# Altium schematic sheet 智能笔.SchDoc
size A1
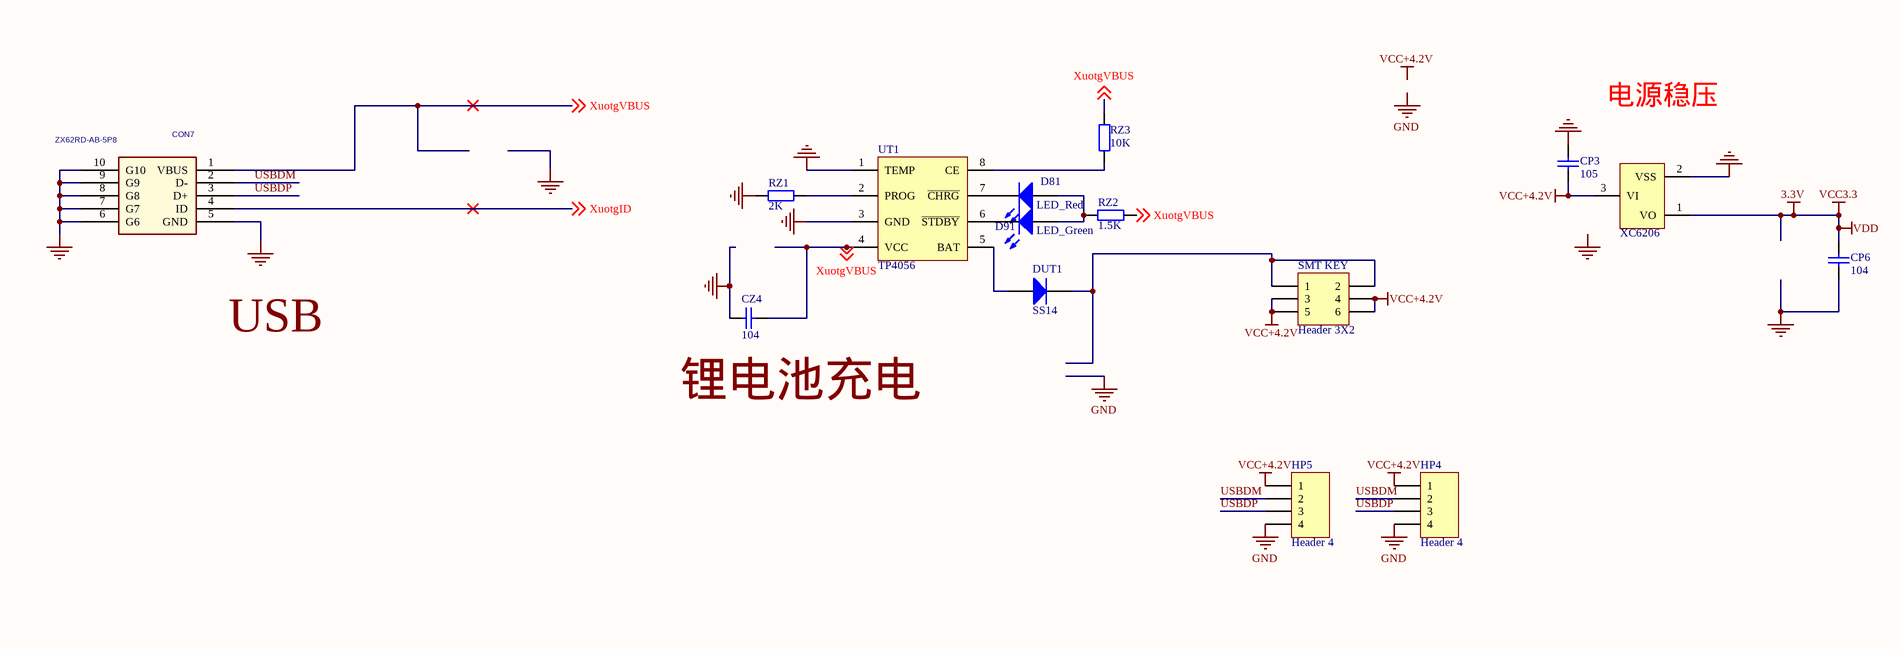
[diagram p0: 智能笔.SchDoc, top left]
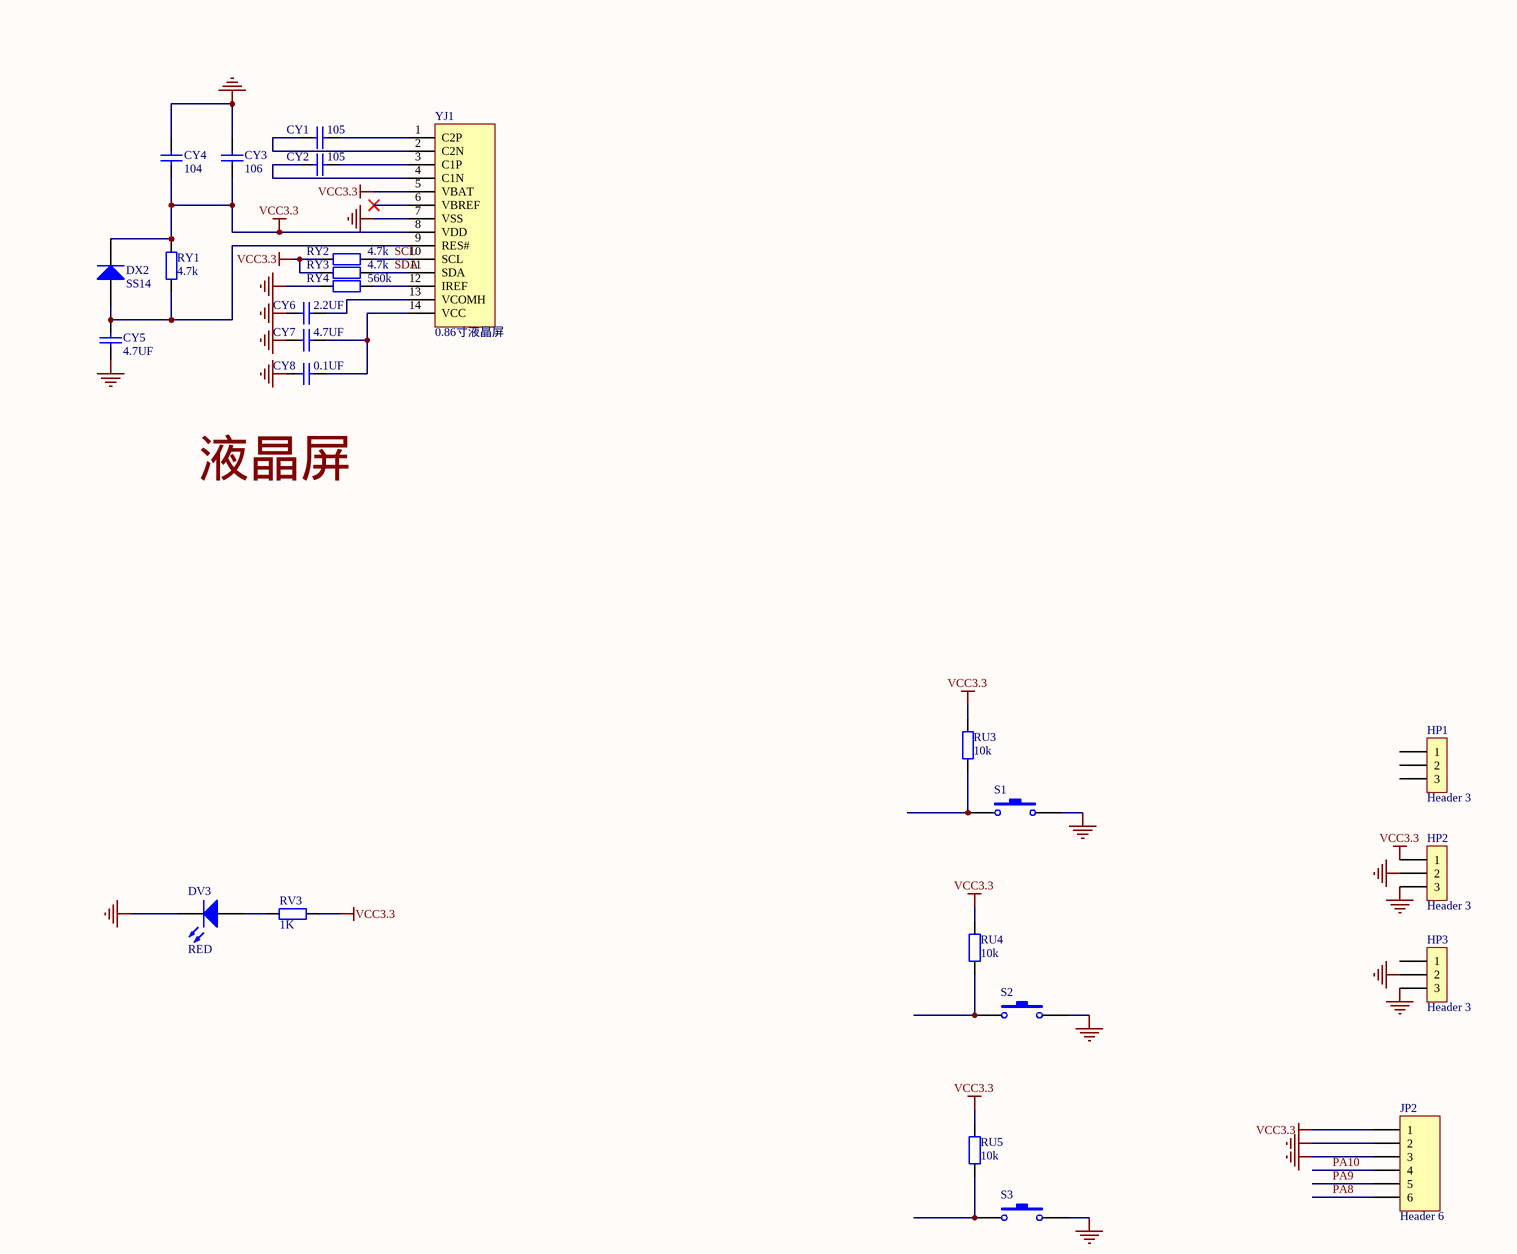
[diagram p1: 智能笔.SchDoc, top right]
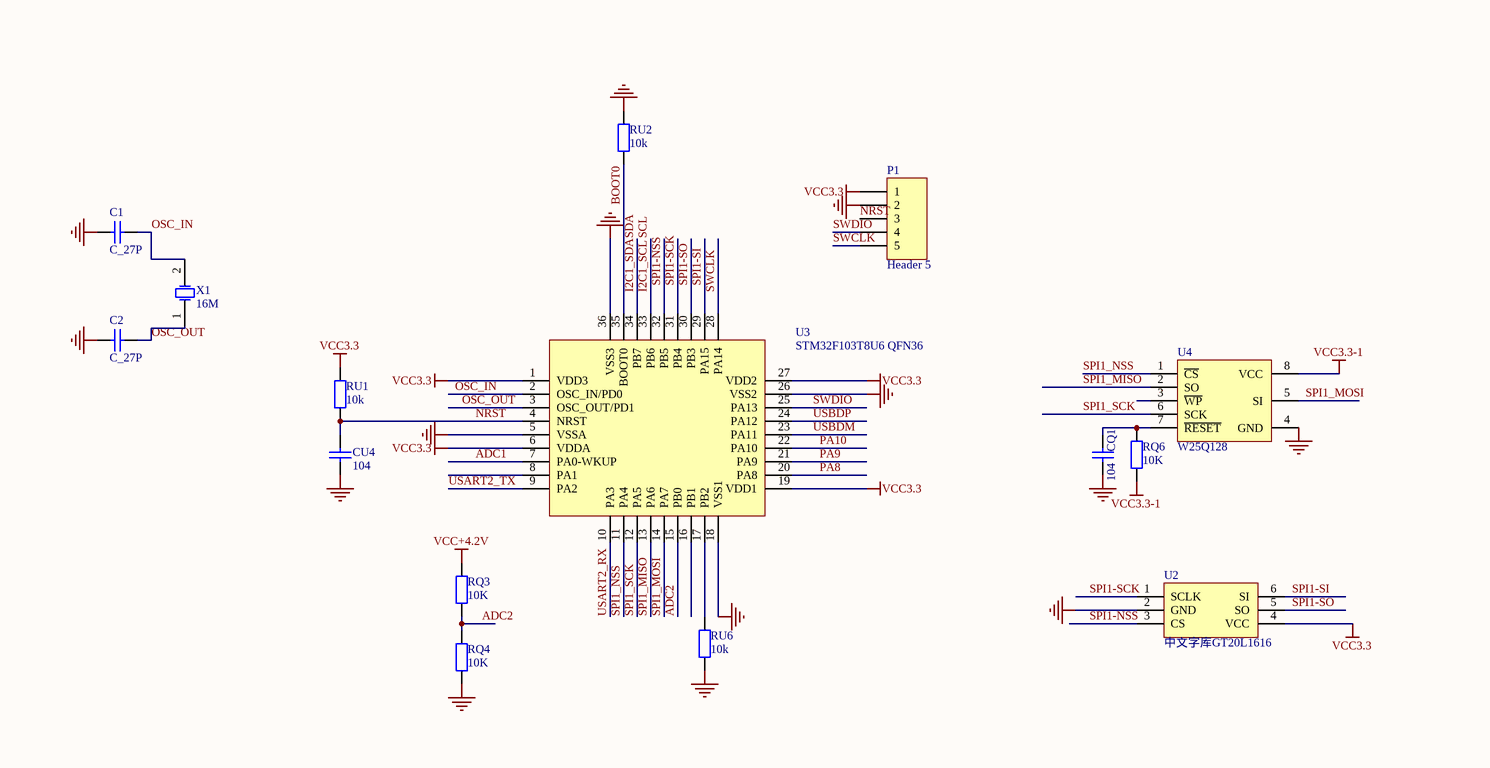
[diagram p2: 智能笔.SchDoc, bottom left]

## Parts
C1  C_27P  [0402]
C2  C_27P  [0402]
CON7  ZX62RD-AB-5P8  [MICROUSB-B-H4]
CP3  105  [0402]
CP6  104  [0402]
CQ1  104  [0402]
CU4  104  [0402]
CY1  105  [0402]
CY2  105  [0402]
CY3  106  [0603-1]
CY4  104  [0402]
CY5  4.7UF  [0603-1]
CY6  2.2UF  [0603-1]
CY7  4.7UF  [0603-1]
CY8  0.1UF  [0402]
CZ4  104  [0402]
D81  LED_Red  [0603]
D91  LED_Green  [0603]
DUT1  SS14  [DIODE_SOP]
DV3  RED  [0603]
DX2  SS14  [DIODE_SOP]
HP1  Header 3  [2.0 3P 焊盘]
HP2  Header 3  [2.0 3P 焊盘]
HP3  Header 3  [2.0 3P 焊盘]
HP4  Header 4  [2.0 4P 焊盘]
HP5  Header 4  [2.0 4P 焊盘]
JP2  Header 6  [1.27MM  6H - 焊接]
P1  Header 5  [2.0 1*5P]
RQ3  10K  [0402]
RQ4  10K  [0402]
RQ6  10K  [0402]
RU1  10k  [0402]
RU2  10k  [0402]
RU3  10k  [0402]
RU4  10k  [0402]
RU5  10k  [0402]
RU6  10k  [0402]
RV3  1K  [0402]
RY1  4.7k  [0402]
RY2  4.7k  [0402]
RY3  4.7k  [0402]
RY4  560k  [0402]
RZ1  2K  [0402]
RZ2  1.5K  [0402]
RZ3  10K  [0402]
S1  SW-PB  [SW_smt4*4]  (value not drawn)
S2  SW-PB  [SW_smt4*4]  (value not drawn)
S3  SW-PB  [SW_smt4*4]  (value not drawn)
SMT_KEY  Header 3X2  [拨动开关]
U2  中文字库GT20L1616  [SOT23-6]
U3  STM32F103T8U6 QFN36  [QFN36]
U4  W25Q128  [SST25VF016B]
UT1  TP4056  [SOP-8P]
X1  16M  [Crystal_SOP 2016]
XC6206  XC6206P332MR (662K) 3.3V/0.5A 稳压芯片  [SOT23-3-1]  (value not drawn)
YJ1  0.86寸液晶屏  [0.86寸 oled 显示屏]

## Nets
3.3V: CP6.1 CY3.1 CY4.1 DX2.2(K) HP2.1 JP2.1 P1.1 RU1.1 RU3.2 RU4.2 RU5.2 RV3.1 RY1.2 RY2.2 RY3.2 U2.4(VCC) U3.1(VDD3) U3.6(VDDA) U3.19(VDD1) U3.27(VDD2) XC6206.1(VO) YJ1.5(VBAT) YJ1.8(VDD)  [also labelled VCC3.3, VDD]
GND: C1.1 C2.1 CON7.5(GND) CON7.6(G6) CON7.7(G7) CON7.8(G8) CON7.9(G9) CON7.10(G10) CP3.1 CP6.2 CQ1.2 CU4.2 CY3.2 CY4.2 CY5.1 CY6.2 CY7.2 CY8.2 CZ4.1 DV3.2(K) HP2.2 HP2.3 HP3.2 HP3.3 HP4.4 HP5.4 JP2.2 JP2.3 P1.2 RQ4.2 RU2.2 RU6.2 RY4.1 RZ1.2 S1.2 S2.2 S3.2 U2.2(GND) U3.5(VSSA) U3.18(VSS1) U3.26(VSS2) U3.36(VSS3) U4.4(GND) UT1.1(TEMP) UT1.3(GND) XC6206.2(VSS) YJ1.7(VSS)
VCC3.3-1: RQ6.2 U4.8(VCC)
VCC+4.2V: CP3.2 HP4.1 HP5.1 RQ3.1 SMT_KEY.3 SMT_KEY.4 SMT_KEY.5 SMT_KEY.6 XC6206.3(VI)
ADC1: U3.7(PA0-WKUP)
ADC2: RQ3.2 RQ4.1 U3.15(PB0)
BOOT0: RU2.1 U3.35(BOOT0)
I2C1_SCL: RY2.1 U3.33(PB6) YJ1.10(SCL)  [also labelled SCL]
I2C1_SDA: RY3.1 U3.34(PB7) YJ1.11(SDA)  [also labelled SDA]
NRST: CU4.1 P1.3 RU1.2 U3.4(NRST)
OSC_IN: C1.2 U3.2(OSC_IN/PD0) X1.2(OSC2)
OSC_OUT: C2.2 U3.3(OSC_OUT/PD1) X1.1(OSC1)
PA8: JP2.6 U3.20(PA8)
PA9: JP2.5 U3.21(PA9)
PA10: JP2.4 U3.22(PA10)
SPI1-NSS: U2.3(CS) U3.32(PB5)
SPI1-SCK: U2.1(SCLK) U3.31(PB4)
SPI1-SI: U2.6(SI) U3.29(PA15)
SPI1-SO: U2.5(SO) U3.30(PB3)
SPI1_MISO: U3.13(PA6) U4.2(SO)
SPI1_MOSI: U3.14(PA7) U4.5(SI)
SPI1_NSS: U3.11(PA4) U4.1(~{CS})
SPI1_SCK: U3.12(PA5) U4.6(SCK)
SWCLK: P1.5 U3.28(PA14)
SWDIO: P1.4 U3.25(PA13)
USART2_RX: U3.10(PA3)
USART2_TX: U3.9(PA2)
USBDM: CON7.2(D-) HP4.2 HP5.2 U3.23(PA11)
USBDP: CON7.3(D+) HP4.3 HP5.3 U3.24(PA12)
XuotgID: CON7.4(ID) ; off-sheet XuotgID
XuotgVBUS: CON7.1(VBUS) CZ4.2 RZ2.1 RZ3.1 UT1.4(VCC) ; off-sheet XuotgVBUS
NetCQ1_1: CQ1.1 RQ6.1 U4.7(~{RESET})
NetCY1_1: CY1.1 YJ1.1(C2P)
NetCY1_2: CY1.2 YJ1.2(C2N)
NetCY2_1: CY2.1 YJ1.3(C1P)
NetCY2_2: CY2.2 YJ1.4(C1N)
NetCY5_2: CY5.2 DX2.1(A) RY1.1 YJ1.9(RES#)
NetCY6_1: CY6.1 YJ1.13(VCOMH)
NetCY7_1: CY7.1 CY8.1 YJ1.14(VCC)
NetD81_1: D81.1(A) D91.1(A) RZ2.2
NetD81_2: D81.2(K) UT1.7(~{CHRG})
NetD91_2: D91.2(K) UT1.6(~{STDBY})
NetDUT1_1: DUT1.1(A) UT1.5(BAT)
NetDUT1_2: DUT1.2(K) SMT_KEY.1 SMT_KEY.2
NetDV3_1: DV3.1(A) RV3.2
NetRU3_1: RU3.1 S1.1
NetRU4_1: RU4.1 S2.1
NetRU5_1: RU5.1 S3.1
NetRU6_1: RU6.1 U3.17(PB2)
NetRY4_2: RY4.2 YJ1.12(IREF)
NetRZ1_1: RZ1.1 UT1.2(PROG)
NetRZ3_2: RZ3.2 UT1.8(CE)

Not connected (* = marked no-connect by the designer): HP1 1 2 3; HP3 1; U3 8(PA1) 16(PB1); U4 3(~{WP}); YJ1 6(VBREF)*

## Notes on the sheet
- 电源稳压
- Labels drawn without touching a wire or pin: GND, USB, VCC+4.2V, 液晶屏, 锂电池充电

## Library data of the parts
C1 C2 = Cap: Capacitor; Published: 8-Jun-2000; LatestRevisionDate: 17-Jul-2002; LatestRevisionNote: Re-released for DXP Platform.; Publisher: Altium Limited
CON7 = ZX62RD-AB-5P8_4
CP3 CY1 CY2 = 104: Capacitor; Value: 104; Published: 8-Jun-2000; LatestRevisionDate: 17-Jul-2002; LatestRevisionNote: Re-released for DXP Platform.; PackageReference: RAD-0.3; Publisher: Altium Limited
CP6 CU4 CY3-CY8 = Cap: Capacitor; Value: 0.01uF; Published: 8-Jun-2000; LatestRevisionDate: 17-Jul-2002; LatestRevisionNote: Re-released for DXP Platform.; PackageReference: RAD-0.3; Publisher: Altium Limited
CQ1 CZ4 = 104: Capacitor; Published: 8-Jun-2000; LatestRevisionDate: 17-Jul-2002; LatestRevisionNote: Re-released for DXP Platform.; PackageReference: RAD-0.3; Publisher: Altium Limited; Value: 104
D81 D91 DV3 = LED1: Typical RED GaAs LED; Published: 8-Jun-2000; LatestRevisionDate: 08-Jul-2005; LatestRevisionNote: Mech Layer 1 removed.; PackageReference: LED-1; Publisher: Altium Limited
DUT1 DX2 = Diode 1N4001: 1 Amp General Purpose Rectifier; Published: 8-Jun-2000; LatestRevisionDate: 17-Jul-2002; LatestRevisionNote: Re-released for DXP Platform.; DatasheetDocument: 1998; PackageDocument: Aug-1999; PackageReference: DO-41; Publisher: Altium Limited; Code_JEDEC: DO-204-AL; ComponentLink1Description: Manufacturer Link; ComponentLink1URL: http://www.fairchildsemi.com/; ComponentLink2Description: Datasheet; ComponentLink2URL: http://www.fairchildsemi.com/ds/1N%2F1N4001.pdf
HP1-HP3 = Header 3: Header, 3-Pin; LatestRevisionDate: 17-Jul-2002; LatestRevisionNote: Re-released for DXP Platform.; Publisher: Altium Limited
HP4 HP5 = Header 4: Header, 4-Pin; LatestRevisionDate: 17-Jul-2002; LatestRevisionNote: Re-released for DXP Platform.; Publisher: Altium Limited
JP2 = Header 6: Header, 6-Pin; LatestRevisionDate: 17-Jul-2002; LatestRevisionNote: Re-released for DXP Platform.; Publisher: Altium Limited
P1 = Header 5: Header, 5-Pin; LatestRevisionDate: 17-Jul-2002; LatestRevisionNote: Re-released for DXP Platform.; Publisher: Altium Limited
RQ3 RQ4 RQ6 RU3-RU5 RY1-RY4 RZ1-RZ3 = Res2: Resistor; Value: 1K; Published: 8-Jun-2000; LatestRevisionDate: 17-Jul-2002; LatestRevisionNote: Re-released for DXP Platform.; PackageReference: AXIAL-0.4; Publisher: Altium Limited
RU1 RU2 RU6 RV3 = Res2: Resistor; Published: 8-Jun-2000; LatestRevisionDate: 17-Jul-2002; LatestRevisionNote: Re-released for DXP Platform.; Publisher: Altium Limited
  RV3: PackageReference: AXIAL-0.4; Value: 1K
S1-S3 = SW-PB: Switch; Published: 24-Mar-1999; LatestRevisionDate: 17-Jul-2002; LatestRevisionNote: Re-released for DXP Platform.; PackageReference: SPST-2; Publisher: Altium Limited
SMT_KEY = Header 3X2: Header, 3-Pin, Dual row; LatestRevisionDate: 17-Jul-2002; LatestRevisionNote: Re-released for DXP Platform.; Publisher: Altium Limited
U4 = SST25VF016B
X1 = XTAL_1: Crystal Oscillator; Published: 8-Jun-2000; LatestRevisionDate: 17-Jul-2002; LatestRevisionNote: Re-released for DXP Platform.; PackageReference: R38; Publisher: Altium Limited